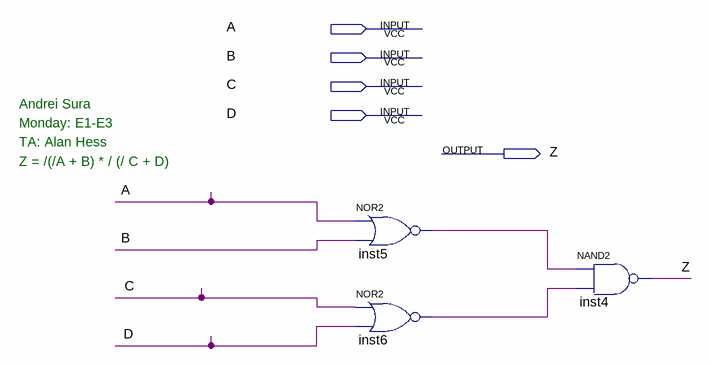
[diagram p0: schematic sheet]
// Quartus schematic lab1_pre_2.bdf as structural Verilog: 3 symbols, 5 pins
module lab1_pre_2 (
  input  A,
  input  B,
  input  C,
  input  D,
  output Z
);

  wire inst5_out, inst6_out;

  nor inst5 (inst5_out, A, B);
  nor inst6 (inst6_out, C, D);
  nand inst4 (Z, inst5_out, inst6_out);

  // Notes on the sheet:
  //   Andrei Sura
  //   Monday: E1-E3
  //   TA: Alan Hess
  //   Z = /(/A + B) * / (/ C + D)
endmodule
